# EAGLE design 77seg (EAGLE 6.2)
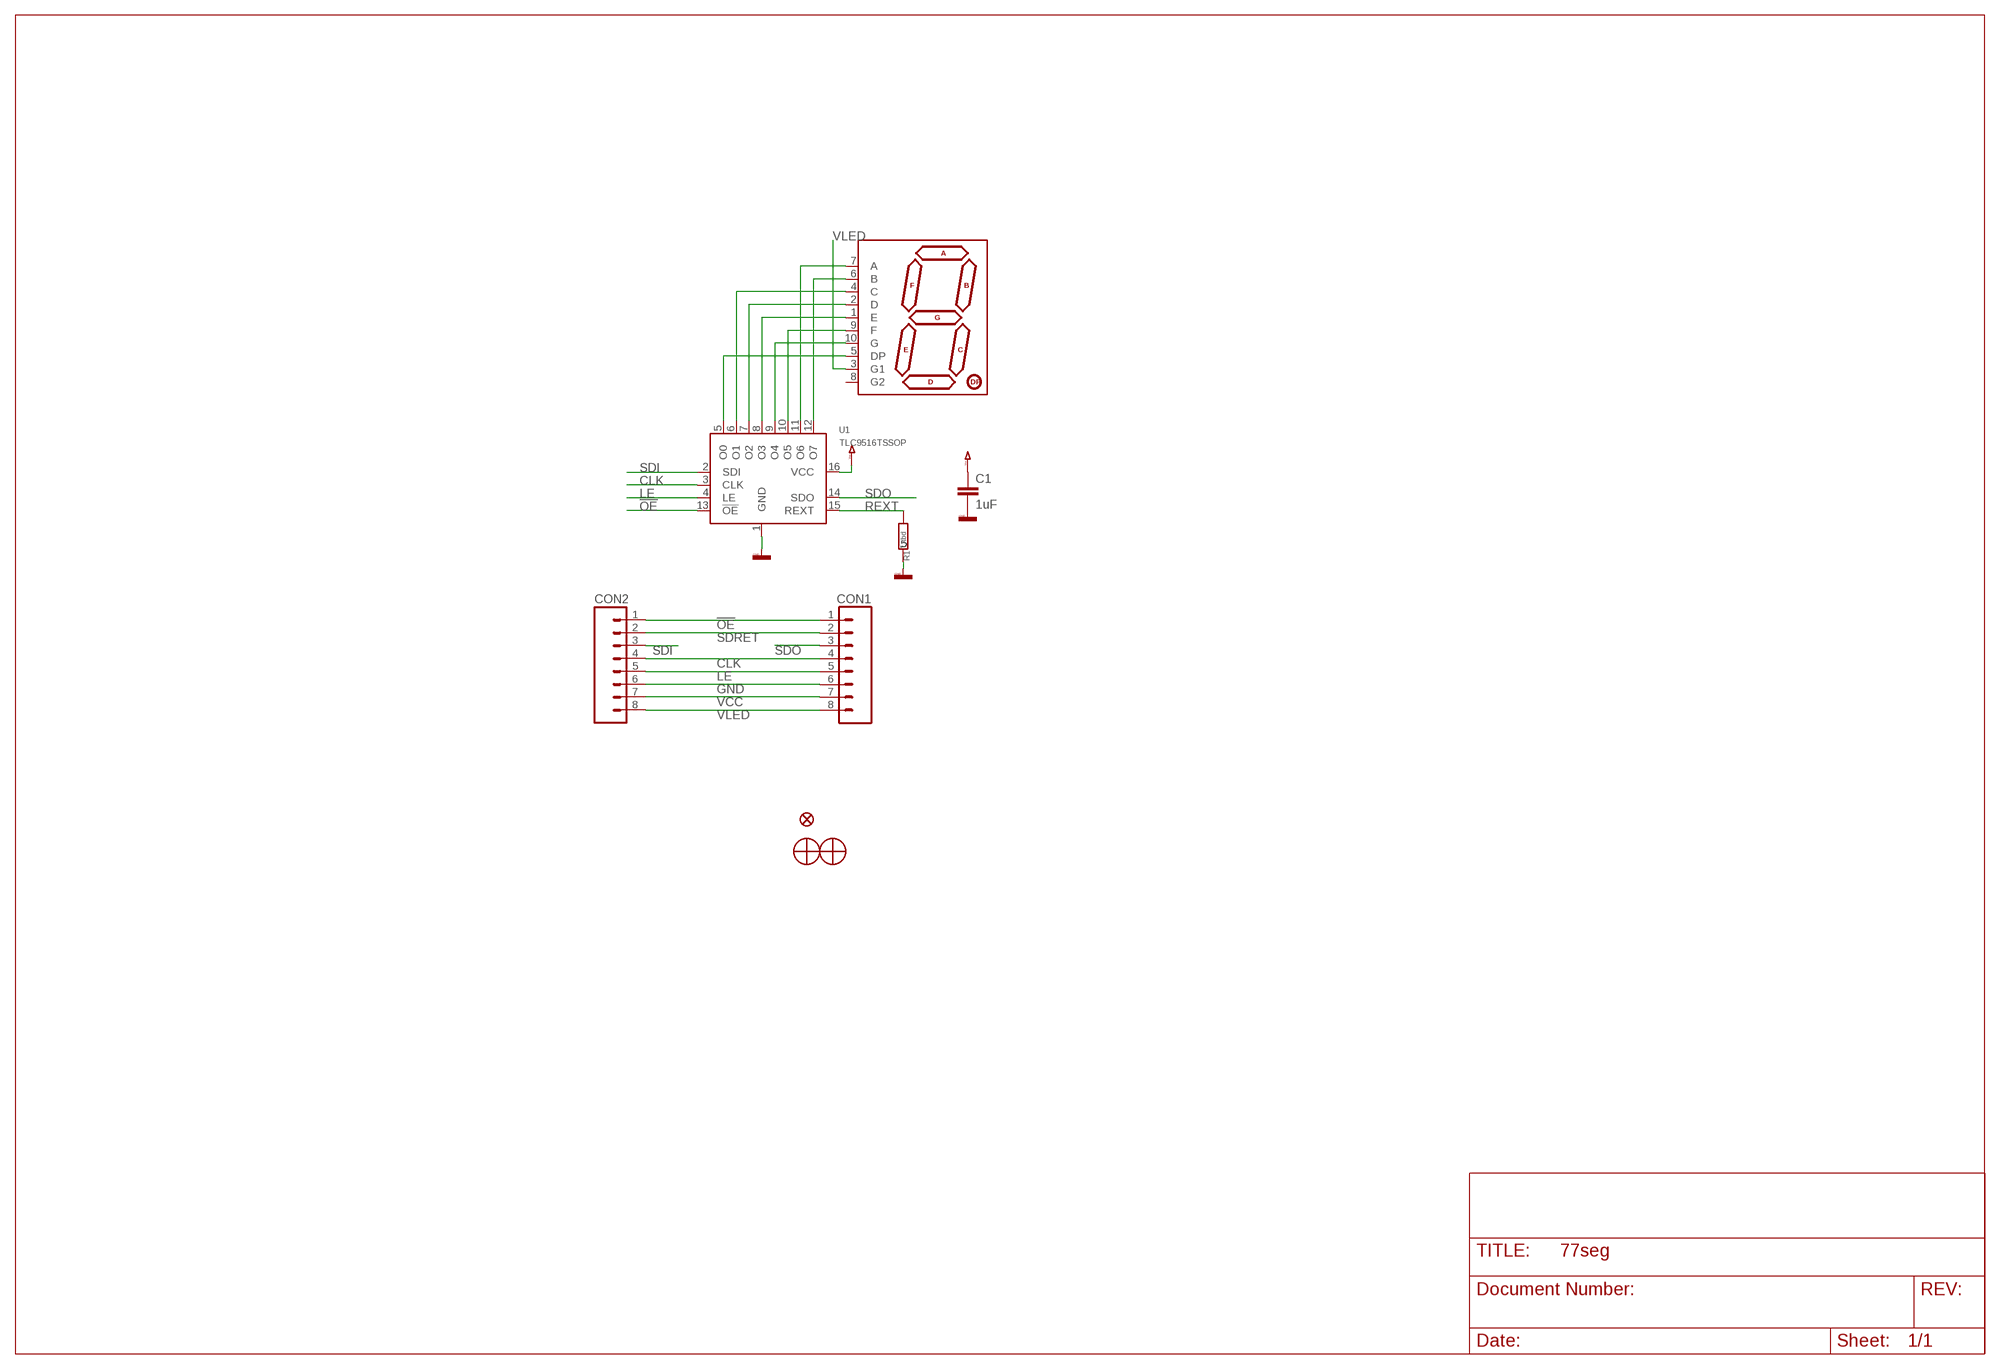
[diagram p0: schematic, sheet 1]

## Parts
C1  1uF  CAP_0603  [C0603]
CON1  M081.27MM_NO1  [1X08_1.27MM_NO1]
CON2  M081.27MM_NO1  [1X08_1.27MM_NO1]
JP1  FIDUCIAL1X1.5  [FIDUCIAL_1X1.5]
R1  tbd  RESISTOR_0603  [R0603]
U1  TLC9516TSSOP  [TSSOP16]
U$1  7-SEGMENT-DISPLAYPTH  [7-SEGMENT-DISPLAY]
U$2  SCREW_NOGND  [SCREW_M2_NOVIAS]
U$3  SCREW_NOGND  [SCREW_M2_NOVIAS]

## Nets
!OE: CON1.1 CON2.1 U1.13(!OE)
CLK: CON1.4 CON2.4 U1.3(CLK)
GND: C1.2 CON1.6 CON2.6 R1.2 U1.1(GND)
LE: CON1.5 CON2.5 U1.4(LE)
N$3: U1.10(O5) U$1.9(F)
N$4: U1.9(O4) U$1.10(G)
N$10: U1.11(O6) U$1.7(A)
N$11: U1.12(O7) U$1.6(B)
N$12: U1.6(O1) U$1.4(C)
N$13: U1.7(O2) U$1.2(D)
N$14: U1.8(O3) U$1.1(E)
N$17: U1.5(O0) U$1.5(DP)
REXT: R1.1 U1.15(REXT)
SDI: CON2.3 U1.2(SDI)
SDO: CON1.3 U1.14(SDO)
SDRET: CON1.2 CON2.2
VCC: C1.1 CON1.7 CON2.7 U1.16(VCC)
VLED: CON1.8 CON2.8 U$1.3(G1)
Unconnected: U$1.8(G2)

## Library data of the parts
C1 = nanibox_rcl:CAP: CAPACITOR
CON1 CON2 = nanibox_con:M08
JP1 = nanibox:FIDUCIAL: Fiducial Alignment Points Various fiducial points for machine vision alignment.
R1 = nanibox_rcl:RESISTOR
U1 = nanibox:TLC9516
U$1 = nanibox:7-SEGMENT-DISPLAY
U$2 U$3 = nanibox:SCREW_NOGND

## Board
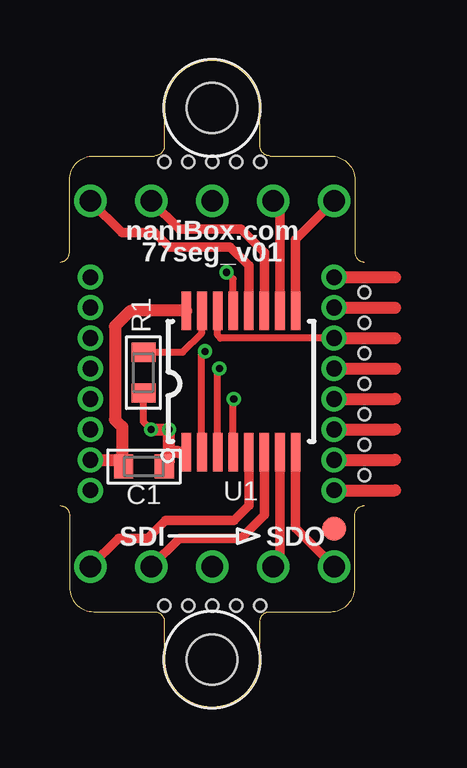
[diagram p1: board, top side]
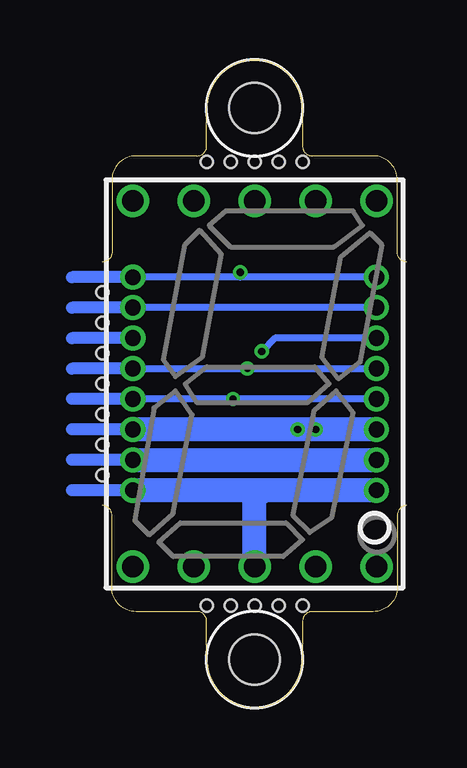
[diagram p2: board, bottom side, seen from below]

Size 12.7 x 27 mm. Coordinates in mm from the lower left corner, seen from the top.
Outline: 12.7,18.58 arc-90 12.3,18.98 12.3,22 arc90 11.3,23 8.75,23 arc-90 8.35,23.4 8.35,25 arc180 4.35,25 4.35,23.4 arc-90 3.95,23 1.4,23 arc90 0.4,22 0.4,18.98 arc-90 0,18.58
Outline: 12.7,8.42 arc90 12.3,8.02 12.3,5 arc-90 11.3,4 8.75,4 arc90 8.35,3.6 8.35,2 arc-180 4.35,2 4.35,3.6 arc90 3.95,4 1.4,4 arc-90 0.4,5 0.4,8.02 arc90 0,8.42
Copper layers (1*16): Top 0.035mm / dielectric 1.5mm / Bottom 0.035mm
Design rules: minimum track width 0.15mm, minimum drill 0.3mm, track to track 0.15mm, track to pad 0.15mm, pad to pad 0.15mm, via to via 0.15mm, smd to smd 0mil, copper to edge 0.18mm, drill to drill 0.2mm, minimum pad ring 0.2mm, minimum via ring 0.15mm, stop-mask expansion 0.05mm, vias tented up to drill 2.5mm, thermal gap 0.25mm
Holes 0.5 mm at 6.35,22.75 7.35,22.75 8.35,22.75 5.35,22.75 4.35,22.75 6.35,4.25 5.35,4.25 4.35,4.25 7.35,4.25 8.35,4.25 12.7,14.77 12.7,16.04 12.7,17.31 12.7,13.5 12.7,12.23 12.7,10.96 12.7,9.69

### Footprints (pad centres in the part's own frame; a part is rotated, then mirrored left to right if it is on the bottom)
C0603 = smd 0.8 x 1: 1 -0.85,0; 2 0.85,0
1X08_1.27MM_NO1 = drill 0.65 pad 0.9: 1 0,0; 2 1.27,0; 3 2.54,0; 4 3.81,0; 5 5.08,0; 6 6.35,0; 7 7.62,0; 8 8.89,0
FIDUCIAL_1X1.5 = smd 1 x 1: 1 0,0
R0603 = smd 0.8 x 1: 1 -0.85,0; 2 0.85,0
TSSOP16 = smd 0.4 x 1.6: 1 -2.275,-2.85; 2 -1.625,-2.85; 3 -0.975,-2.85; 4 -0.325,-2.85; 5 0.325,-2.85; 6 0.975,-2.85; 7 1.625,-2.85; 8 2.275,-2.85; 9 2.275,3.05; 10 1.625,3.05; 11 0.975,3.05; 12 0.325,3.05; 13 -0.325,3.05; 14 -0.975,3.05; 15 -1.625,3.05; 16 -2.275,3.05
7-SEGMENT-DISPLAY = drill 0.9 pad 1.35: 1 -5.08,-7.62; 2 -2.54,-7.62; 3 0,-7.62; 4 2.54,-7.62; 5 5.08,-7.62; 6 5.08,7.62; 7 2.54,7.62; 8 0,7.62; 9 -2.54,7.62; 10 -5.08,7.62
SCREW_M2_NOVIAS = hole 2.1: 0,0

### Placement (x,y rotation side)
C1  3.5,10.05 0 top
CON1  11.43,17.95 270 top
CON2  1.27,17.95 270 top
JP1  11.43,7.47 0 top
R1  3.48,13.96 270 top
U1  7.55,13.5 0 top
U$1  6.35,13.5 0 bottom
U$2  6.35,2 0 top
U$3  6.35,25 0 top

### Tracks (layer width: path | path; a pad name or v marks a point on that pad's centre or on a via)
!OE  (via drill 0.3)  (1 unrouted)
  Top 0.3: U1.13 7.22,17.88 v6.95,18.15
  Top 0.5: CON1.1 13.97,17.95
  Bottom 0.3: CON2.1 6.95,17.95 | 6.95,17.95 CON1.1 | v6.95,18.15 6.95,17.95
  Bottom 0.5: CON1.1 13.97,17.95
CLK  (via drill 0.3)  (1 unrouted)
  Top 0.3: U1.3 6.57,14.06 v6.65,14.13
  Top 0.5: CON1.4 13.97,14.13
  Bottom 0.3: CON1.4 v6.65,14.13 CON2.4
  Bottom 0.5: CON1.4 13.97,14.13
GND  (via drill 0.3)  (1 unrouted)
  Top 0.3: v3.8,11.6 3.48,11.91 R1.2
  Top 0.4: U1.1 4.95,10.65
  Top 0.5: v3.8,11.6 v4.55,11.6 4.55,10.65 | C1.2 4.55,10.25 4.55,10.65 | 4.95,10.65 4.55,10.65 | CON1.6 13.97,11.6
  Bottom 0.5: CON1.6 13.97,11.6
  Bottom 1: CON2.6 v4.55,11.6 CON1.6
LE  (via drill 0.3)  (1 unrouted)
  Top 0.3: U1.4 7.22,12.84 v7.25,12.87
  Top 0.5: CON1.5 13.97,12.87
  Bottom 0.3: CON2.5 v7.25,12.87 CON1.5
  Bottom 0.5: CON1.5 13.97,12.87
N$3
  Top 0.4: U$1.9 9.18,20.84 U1.10
N$4
  Top 0.4: U1.9 9.82,19.52 U$1.10
N$10
  Top 0.4: U$1.7 4.98,19.95 7.55,19.95 8.52,18.98 U1.11
N$11
  Top 0.4: U$1.6 2.59,19.8 3.95,19.8 4.55,19.2 7.1,19.2 7.88,18.43 U1.12
N$12
  Top 0.4: U$1.4 4.98,7.05 7.55,7.05 8.52,8.03 U1.6
N$13
  Top 0.4: U$1.2 9.18,6.17 U1.7
N$14
  Top 0.4: U1.8 9.82,7.49 U$1.1
N$17
  Top 0.4: U$1.5 2.44,7.05 3.65,7.05 4.4,7.8 7.25,7.8 7.88,8.43 U1.5
REXT
  Top 0.3: R1.1 5.11,14.81 5.92,15.62 U1.15
SDI  (via drill 0.3)
  Top 0.3: U1.2 5.9,10.68 5.9,14.7 v6.05,14.85
  Bottom 0.3: CON2.3 5.49,15.4 v6.05,14.85
SDO  (1 unrouted)
  Top 0.3: CON1.3 6.69,15.4 6.57,15.53 U1.14
  Top 0.5: CON1.3 13.97,15.4
  Bottom 0.5: CON1.3 13.97,15.4
SDRET  (1 unrouted)
  Top 0.5: CON1.2 13.97,16.68
  Bottom 0.3: CON2.2 CON1.2
  Bottom 0.5: CON1.2 13.97,16.68
VCC  (1 unrouted)
  Top 0.4: 2.37,10.32 C1.1 | 2.65,10.4 C1.1 | 2.6,10.1 C1.1
  Top 0.5: CON2.7 2.37,10.32 | U1.16 2.95,16.55 2.3,15.9 2.3,12 2.6,11.7 2.6,10.1 | CON1.7 13.97,10.32
  Bottom 0.5: CON1.7 13.97,10.32
  Bottom 1: CON1.7 CON2.7
VLED  (1 unrouted)
  Top 0.5: CON1.8 13.97,9.05
  Bottom 0.5: CON1.8 13.97,9.05
  Bottom 1: CON2.8 6.03,9.05 | 6.03,9.05 CON1.8 | U$1.3 6.35,8.74 6.03,9.05

### Text on the board
tPlace: naniBox.com | 77seg_v01 | SDI | SDO
_tNames: R1 | C1 | U1